# EAGLE design mac_se_power_switch (EAGLE 9.6.1)
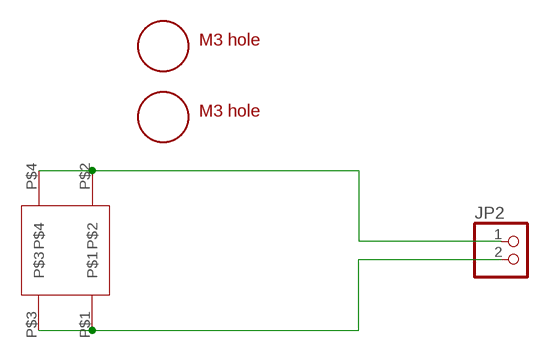
[diagram p0: schematic, sheet 1]

## Parts
JP2  PINHD-1X2/90  [1X02/90]
U$1  ROCK_SW  [ROCK_SWITCH]
U$2  M3_MOUNTING_HOLE  [M3_MOUNTING_HOLE_PACK]
U$3  M3_MOUNTING_HOLE  [M3_MOUNTING_HOLE_PACK]

## Nets
N$2: JP2.2 U$1.P$1 U$1.P$3
N$3: JP2.1 U$1.P$2 U$1.P$4

## Library data of the parts
JP2 = pinhead:PINHD-1X2: PIN HEADER
U$1 = atx4vc:ROCK_SW
U$2 U$3 = a:M3_MOUNTING_HOLE

## Board
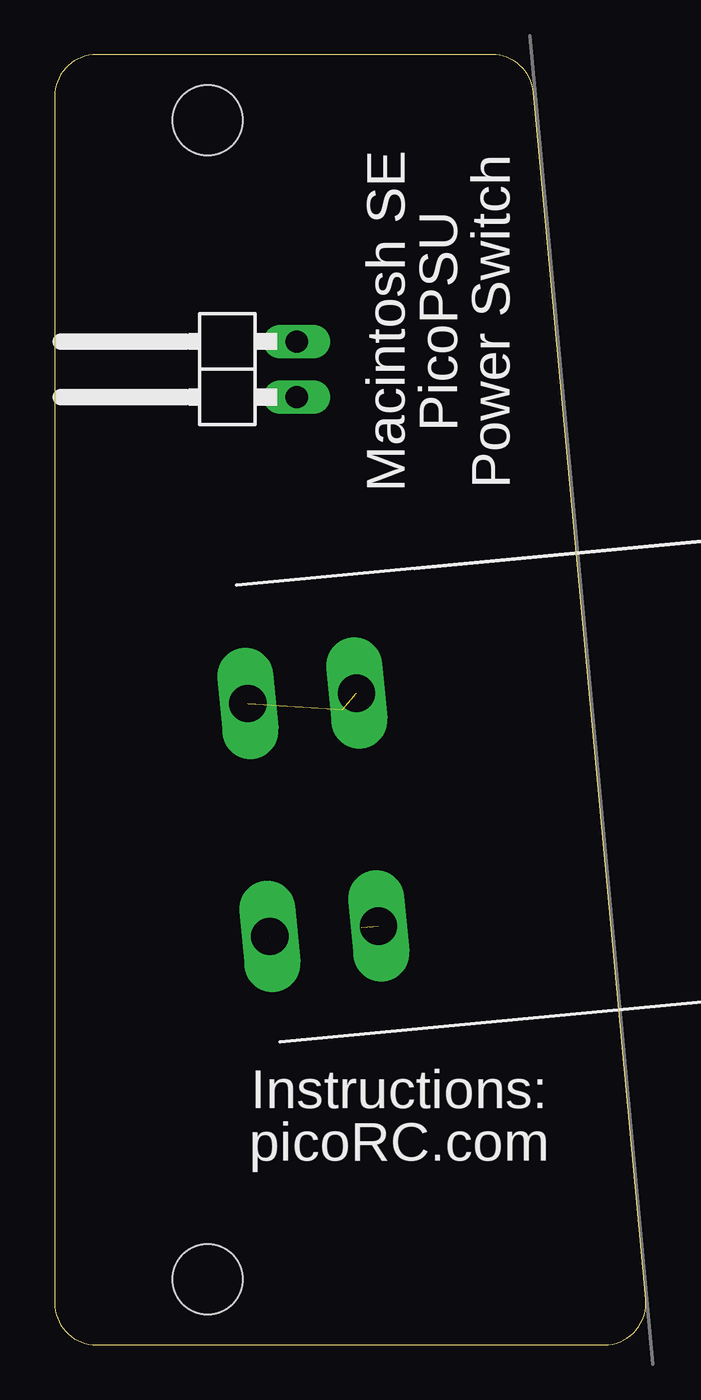
[diagram p1: board, top side]
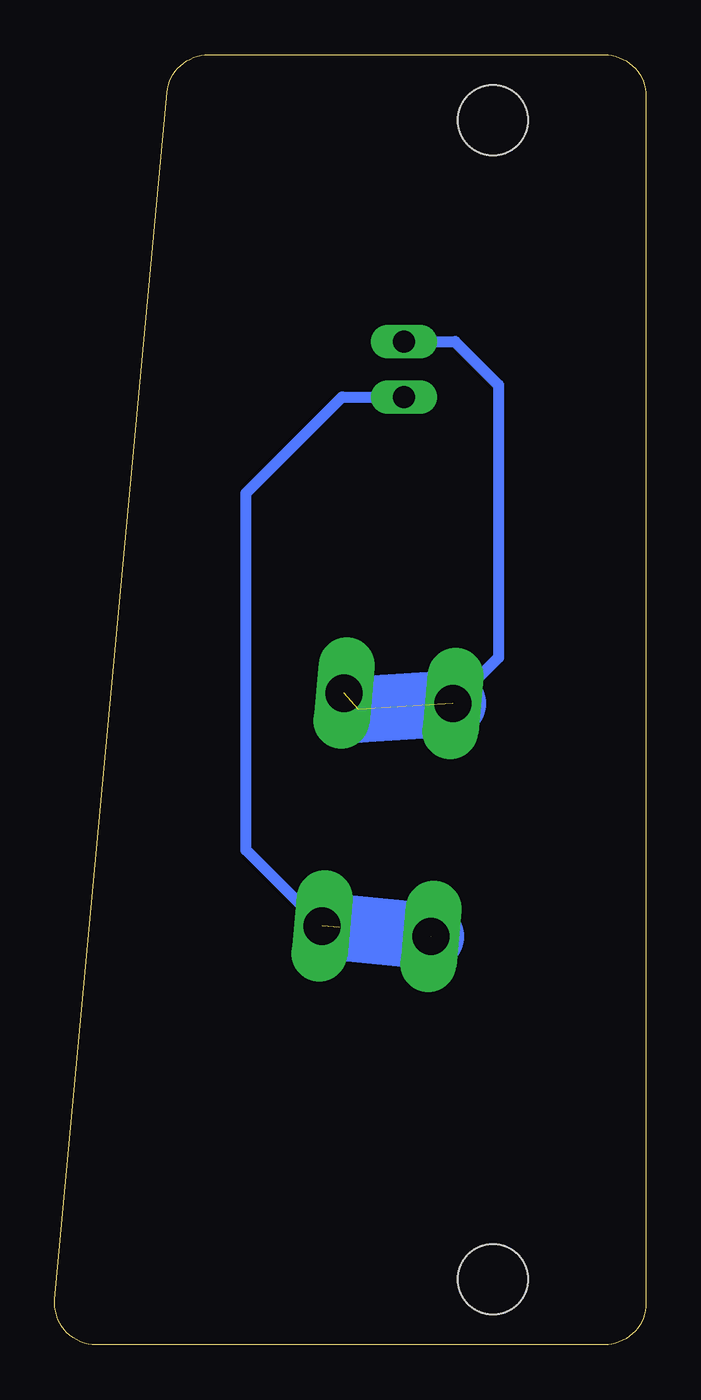
[diagram p2: board, bottom side, seen from below]

Size 27.05 x 59 mm. Coordinates in mm from the lower left corner, seen from the top.
Outline: 20.01,59 1.91,59 arc90 0,57.09 0,1.91 arc90 1.91,0 25.15,0 arc95 27.04,2.08 21.91,57.27 arc85 20.01,59
Copper layers (1*16): Top 0.035mm / dielectric 1.5mm / Bottom 0.035mm
Design rules "deku_2layer_6mil *": minimum track width 6mil, minimum drill 15mil, track to track 20mil, track to pad 6mil, pad to pad 6mil, via to via 6mil, smd to smd 6mil, copper to edge 10mil, drill to drill 6mil, minimum pad ring 7mil, minimum via ring 7mil, stop-mask expansion 4mil, vias tented up to drill 25mil, thermal gap 10mil

### Footprints (pad centres in the part's own frame; a part is rotated, then mirrored left to right if it is on the bottom)
1X02/90 = drill 1.016 long: 1 -1.27,-3.81; 2 1.27,-3.81
ROCK_SWITCH = drill 1.7 long: P$1 -5.05,0; P$2 5.65,0; P$3 -5.05,5; P$4 5.65,5
M3_MOUNTING_HOLE_PACK = hole 3.2: 0,0

### Placement (x,y rotation side)
JP2  7.26,44.61 90 top
U$1  9.31,24.3 275.4 top
U$2  7,3 0 top
U$3  7,56 0 top

### Tracks (layer width: path | path; a pad name or v marks a point on that pad's centre or on a via)
N$2  (2 unrouted)
  Bottom 0.508: JP2.2 8.73,45.88 6.75,43.89 6.75,31.42 U$1.P$1
  Bottom 3.048: U$1.P$1 13.16,29.05
N$3  (2 unrouted)
  Bottom 0.508: U$1.P$4 18.3,22.63 18.3,38.94 13.9,43.34 JP2.1
  Bottom 3.048: U$1.P$2 14.03,19.09

### Text on the board
tNames: Macintosh SE / PicoPSU / Power Switch | Instructions: / picoRC.com